# Altium schematic sheet SPEC_A7.SchDoc
size 420 x 297 mm; EDA_Number: ARTIQ; ModifiedBy: -; CreateDate: 20/06/2024; CheckedDate: -; DivGrp: ISE; Designer: A.B.; DrawnBy: A.B.; Organization: Wydział Elektroniki i Technik Informacyjnych; Address1: ul. Nowowiejska 15/19; Address2: 00-665 Warszawa; Address3: NSW; Address4: Polska; Revision: 0; SheetNumber: 2; SheetTotal: 5
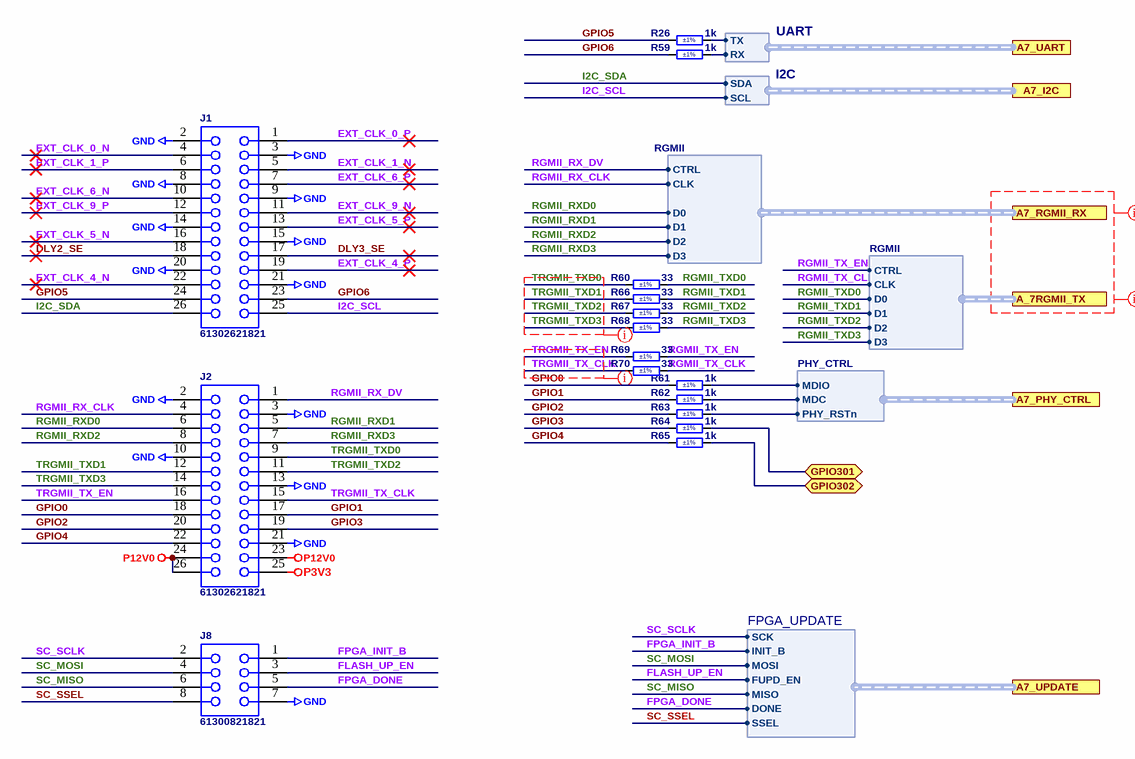
[diagram p0: SPEC_A7.SchDoc]

## Parts
J1  61302621821  [61302621821]
J2  61302621821  [61302621821]
J8  61300821821  [61300821821]
R26  1k  Tolerance: ±1%  [RESC1005X40N]
R59  1k  Tolerance: ±1%  [RESC1005X40N]
R60  33  Tolerance: ±1%  [RESC1005X40N]
R61  1k  Tolerance: ±1%  [RESC1005X40N]
R62  1k  Tolerance: ±1%  [RESC1005X40N]
R63  1k  Tolerance: ±1%  [RESC1005X40N]
R64  1k  Tolerance: ±1%  [RESC1005X40N]
R65  1k  Tolerance: ±1%  [RESC1005X40N]
R66  33  Tolerance: ±1%  [RESC1005X40N]
R67  33  Tolerance: ±1%  [RESC1005X40N]
R68  33  Tolerance: ±1%  [RESC1005X40N]
R69  33  Tolerance: ±1%  [RESC1005X40N]
R70  33  Tolerance: ±1%  [RESC1005X40N]

## Ports
A7_I2C (harness I2C), A7_PHY_CTRL (harness PHY_CTRL), A7_RGMII_RX (harness RGMII), A7_UART (harness UART), A7_UPDATE (harness FPGA_UPDATE), A_7RGMII_TX (harness RGMII), GPIO301 (bidir), GPIO302 (bidir)

## Harnesses
RGMII: CTRL, CLK, D0, D1, D2, D3
PHY_CTRL: MDIO, MDC, PHY_RSTn
I2C: SCL, SDA
UART: TX, RX
FPGA_UPDATE: SCK, INIT_B, MOSI, FUPD_EN, MISO, DONE, SSEL

## Nets
GND: J1.2 J1.3 J1.8 J1.9 J1.14 J1.15 J1.20 J1.21 J2.2 J2.3 J2.10 J2.13 J2.21 J8.7
P3V3: J2.25
P12V0: J2.23 J2.24 J2.26
DLY2_SE: J1.18
DLY3_SE: J1.17
EXT_CLK_0_N: J1.4
EXT_CLK_0_P: J1.1
EXT_CLK_1_N: J1.5
EXT_CLK_1_P: J1.6
EXT_CLK_4_N: J1.22
EXT_CLK_4_P: J1.19
EXT_CLK_5_N: J1.16
EXT_CLK_5_P: J1.13
EXT_CLK_6_N: J1.10
EXT_CLK_6_P: J1.7
EXT_CLK_9_N: J1.11
EXT_CLK_9_P: J1.12
FLASH_UP_EN: J8.3 ; port A7_UPDATE.FUPD_EN
FPGA_DONE: J8.5 ; port A7_UPDATE.DONE
FPGA_INIT_B: J8.1 ; port A7_UPDATE.INIT_B
GPIO0: J2.18 R61.1
GPIO1: J2.17 R62.1
GPIO2: J2.20 R63.1
GPIO3: J2.19 R64.1
GPIO4: J2.22 R65.1
GPIO5: J1.24 R26.1
GPIO6: J1.23 R59.1
GPIO301: R64.2 ; port GPIO301
GPIO302: R65.2 ; port GPIO302
I2C_SCL: J1.25 ; port A7_I2C.SCL
I2C_SDA: J1.26 ; port A7_I2C.SDA
RGMII_RX_CLK: J2.4 ; port A7_RGMII_RX.CLK
RGMII_RX_DV: J2.1 ; port A7_RGMII_RX.CTRL
RGMII_RXD0: J2.6 ; port A7_RGMII_RX.D0
RGMII_RXD1: J2.5 ; port A7_RGMII_RX.D1
RGMII_RXD2: J2.8 ; port A7_RGMII_RX.D2
RGMII_RXD3: J2.7 ; port A7_RGMII_RX.D3
RGMII_TX_CLK: R70.2 ; port A_7RGMII_TX.CLK
RGMII_TX_EN: R69.2 ; port A_7RGMII_TX.CTRL
RGMII_TXD0: R60.2 ; port A_7RGMII_TX.D0
RGMII_TXD1: R66.2 ; port A_7RGMII_TX.D1
RGMII_TXD2: R67.2 ; port A_7RGMII_TX.D2
RGMII_TXD3: R68.2 ; port A_7RGMII_TX.D3
SC_MISO: J8.6 ; port A7_UPDATE.MISO
SC_MOSI: J8.4 ; port A7_UPDATE.MOSI
SC_SCLK: J8.2 ; port A7_UPDATE.SCK
SC_SSEL: J8.8 ; port A7_UPDATE.SSEL
TRGMII_TX_CLK: J2.15 R70.1
TRGMII_TX_EN: J2.16 R69.1
TRGMII_TXD0: J2.9 R60.1
TRGMII_TXD1: J2.12 R66.1
TRGMII_TXD2: J2.11 R67.1
TRGMII_TXD3: J2.14 R68.1
NetR26_2: R26.2 ; port A7_UART.TX
NetR59_2: R59.2 ; port A7_UART.RX
NetR61_2: R61.2 ; port A7_PHY_CTRL.MDIO
NetR62_2: R62.2 ; port A7_PHY_CTRL.MDC
NetR63_2: R63.2 ; port A7_PHY_CTRL.PHY_RSTn

## Layout directives
net class FPGA_RGMII_RXTX: (no net found under the mark)
net class SE50: (no net found under the mark), TRGMII_TX_CLK, TRGMII_TX_EN, TRGMII_TXD0, TRGMII_TXD1, TRGMII_TXD2, TRGMII_TXD3

## Notes on the sheet
- Project/Equipment
- Document
- Designer
- Drawn by
- Check.by
- Copyright WUT ISE 2024.
  This documentation describes Open Hardware and is licensed under the CERN OHL v.2. You may redistribute and modify this documentation under the terms of the CERN OHL v.2. (http://ohwr.org/CERNOHL). This documentation is distributed WITHOUT ANY EXPRESS OR IMPLIED WARRANTY, INCLUDING OF MERCHANTABILITY, SATISFACTORY QUALITY AND FITNESS FOR A PARTICULAR PURPOSE. Please see the CERN OHL v.2 for applicable conditions.
- Contact
- File
- Last Mod.
- Print Date
- Sheet
- Size
- A3
- of
- Rev

## Library data of the parts
J1 J2 = 61302621821: WR-PHD Socket Header, THT, Vertical, pitch 2.54mm, 2 Row, 26P; Manufacturer: Wurth Elektronik; Contact Resistance: 20mOhm; Rated Current: 3A; Working Voltage: 250V; Withstanding Voltage: 500V; Manufacturer Part Number: 61302621821; Category: Board-to-Board Connectors; Match Code: WR-PHD; ComponentLink1Description: Website Link; ComponentLink1URL: https://www.we-online.com/redexpert/article/61302621821?ad; ComponentLink2Description: Datasheet Link; ComponentLink2URL: https://www.we-online.com/redexpert/spec/61302621821?ad; Mount: Through Hole; Operating Temperature Max: 125°C; Operating Temperature Min: -40°C; Packaging: Tray; Gender: Socket Header; Number of Pins: 26; Number of Rows: 2; Orientation: Vertical; Pitch: 2.54mm
J8 = 61300821821: WR-PHD Socket Header, THT, Vertical, pitch 2.54mm, 2 Row, 8P; Manufacturer: Wurth Elektronik; Contact Resistance: 20mOhm; Rated Current: 3A; Working Voltage: 250V; Withstanding Voltage: 500V; Manufacturer Part Number: 61300821821; Category: Board-to-Board Connectors; Match Code: WR-PHD; ComponentLink1Description: Website Link; ComponentLink1URL: https://www.we-online.com/redexpert/article/61300821821?ad; ComponentLink2Description: Datasheet Link; ComponentLink2URL: https://www.we-online.com/redexpert/spec/61300821821?ad; Mount: Through Hole; Operating Temperature Max: 125°C; Operating Temperature Min: -40°C; Packaging: Tray; Gender: Socket Header; Number of Pins: 8; Number of Rows: 2; Orientation: Vertical; Pitch: 2.54mm
R26 R59 R61-R65 = R0402_1K_1%_0.0625W_100PPM: Resistor - 1%; Part Description: General Purpose Thick Film Chip Resistor; Manufacturer: GENERIC; Manufacturer1 Part Number: 232270671002L; TC: ±100ppm/°C; PressFit: No; Part Number: R0402_1K_1%_0.0625W_100PPM; Component Kind: Standard; Component Type: Standard; Pin Count: 2; Value: 1k; Status: Not Recommended; Power: 0.0625W; Manufacturer Part Number: R0402_1K_1%_0.0625W_100PPM; Case: 0402; Mounted: Yes; Sense: No; Socket: No; SMD: Yes; Manufacturer1 Example: YAGEO PHYCOMP; Manufacturer1 ComponentHeight: 0.4mm; HelpURL: \\cern.ch\dfs\Applications\Altium\Datasheets\R0402_Phycomp_RC0402.pdf; Author: CERN DEM JLC; CreateDate: 03.12.2007; LatestRevisionDate: 17.10.2012
R60 R66-R70 = R0402_33R_1%_0.0625W_100PPM: Resistor - 1%; Part Description: General Purpose Thick Film Chip Resistor; Manufacturer: GENERIC; Manufacturer1 Part Number: 232270673309L; TC: ±100ppm/°C; PressFit: No; Part Number: R0402_33R_1%_0.0625W_100PPM; Component Kind: Standard; Component Type: Standard; Pin Count: 2; Value: 33; Status: Not Recommended; Power: 0.0625W; Manufacturer Part Number: R0402_33R_1%_0.0625W_100PPM; Case: 0402; Mounted: Yes; Sense: No; Socket: No; SMD: Yes; Manufacturer1 Example: YAGEO PHYCOMP; Manufacturer1 ComponentHeight: 0.4mm; HelpURL: \\cern.ch\dfs\Applications\Altium\Datasheets\R0402_Phycomp_RC0402.pdf; Author: CERN DEM JLC; CreateDate: 03.12.2007; LatestRevisionDate: 17.10.2012